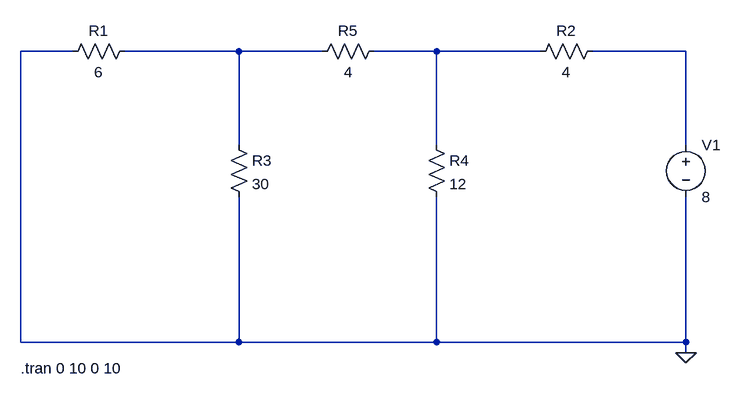
[diagram p0: schematic questão3e2.asc]
questão3e2.asc, the LTspice schematic file:
Version 4
SHEET 1 880 680
WIRE -1120 -176 -1200 -176
WIRE -864 -176 -1040 -176
WIRE -736 -176 -864 -176
WIRE -560 -176 -656 -176
WIRE -400 -176 -560 -176
WIRE -176 -176 -320 -176
WIRE -864 -32 -864 -176
WIRE -560 -32 -560 -176
WIRE -176 -32 -176 -176
WIRE -1200 272 -1200 -176
WIRE -864 272 -864 48
WIRE -864 272 -1200 272
WIRE -560 272 -560 48
WIRE -560 272 -864 272
WIRE -176 272 -176 48
WIRE -176 272 -560 272
WIRE -176 288 -176 272
FLAG -176 288 0
SYMBOL res -1024 -192 R90
WINDOW 0 0 56 VBottom 2
WINDOW 3 32 56 VTop 2
SYMATTR InstName R1
SYMATTR Value 6
SYMBOL res -304 -192 R90
WINDOW 0 0 56 VBottom 2
WINDOW 3 32 56 VTop 2
SYMATTR InstName R2
SYMATTR Value 4
SYMBOL res -880 -48 R0
SYMATTR InstName R3
SYMATTR Value 30
SYMBOL res -576 -48 R0
SYMATTR InstName R4
SYMATTR Value 12
SYMBOL res -640 -192 R90
WINDOW 0 0 56 VBottom 2
WINDOW 3 32 56 VTop 2
SYMATTR InstName R5
SYMATTR Value 4
SYMBOL voltage -176 -48 R0
WINDOW 123 0 0 Left 0
WINDOW 39 0 0 Left 0
SYMATTR InstName V1
SYMATTR Value 8
TEXT -1200 312 Left 2 !.tran 0 10 0 10

The netlist it stands for:
* questão3e2.asc
R1 N001 0 6
R2 N003 N002 4
R3 N001 0 30
R4 N002 0 12
R5 N002 N001 4
V1 N003 0 8
.tran 0 10 0 10
.backanno
.end